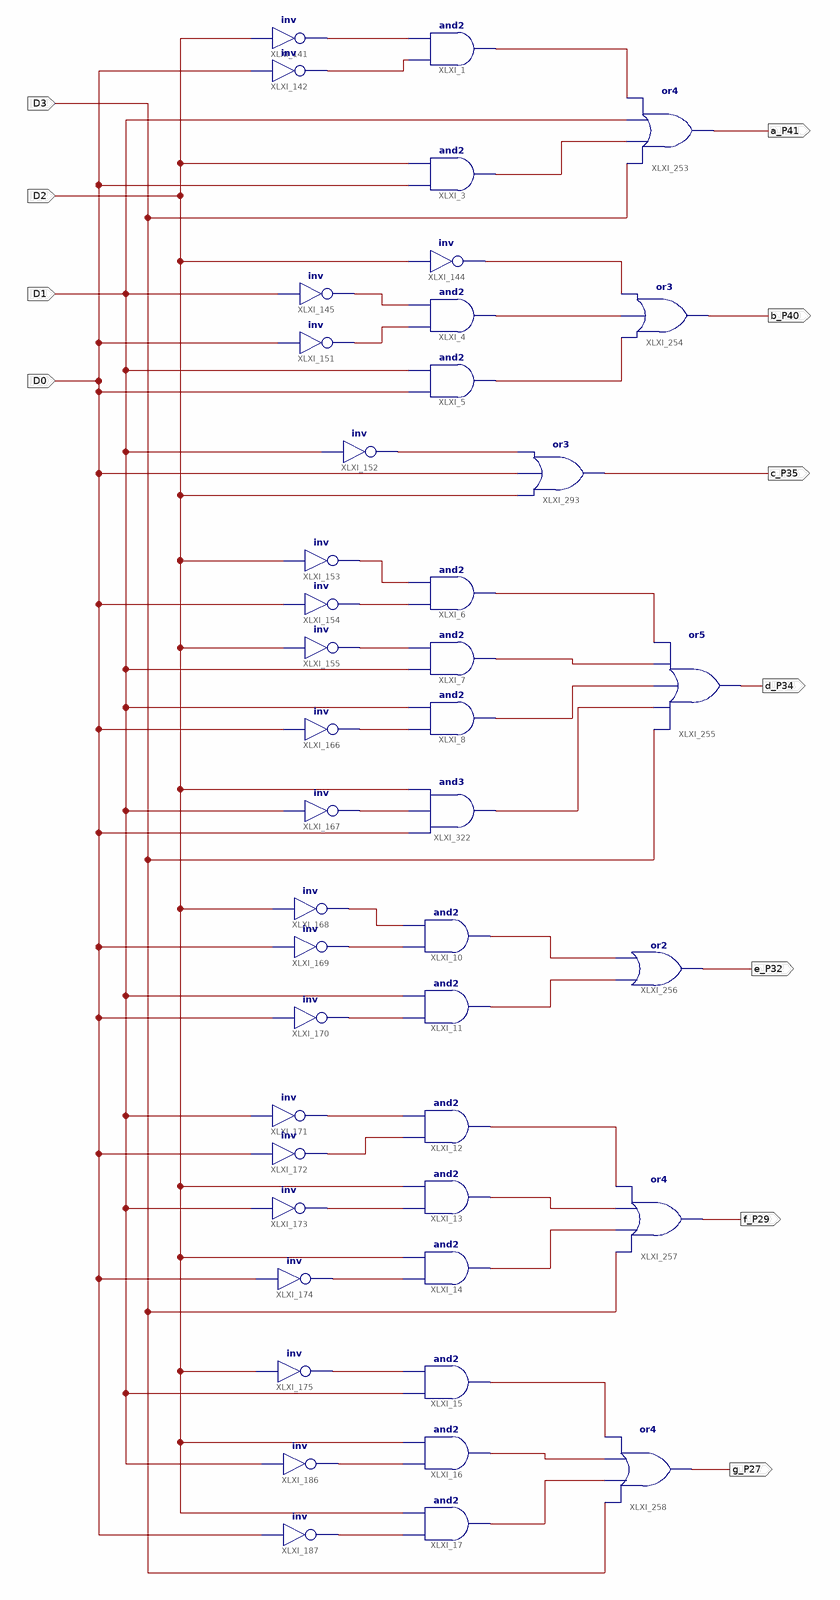
[diagram p0: schematic sheet 1]
// Xilinx ISE schematic sevenSegja.sch (spartan6) as structural Verilog: 44 symbols, 11 ports
module sevenSegja (
  input  D2,
  input  D1,
  input  D0,
  input  D3,
  output a_P41,
  output b_P40,
  output c_P35,
  output d_P34,
  output e_P32,
  output f_P29,
  output g_P27
);

  wire XLXN_11, XLXN_12, XLXN_13, XLXN_15, XLXN_25, XLXN_26, XLXN_27, XLXN_28, XLXN_29, XLXN_30, XLXN_31,
       XLXN_32, XLXN_33, XLXN_34, XLXN_35, XLXN_36, XLXN_37, XLXN_38, XLXN_39, XLXN_40, XLXN_41, XLXN_42,
       XLXN_43, XLXN_44, XLXN_45, XLXN_46, XLXN_47, XLXN_48, XLXN_49, XLXN_50, XLXN_51, XLXN_52, XLXN_53,
       XLXN_54, XLXN_55, XLXN_56, XLXN_57;

  and XLXI_3 (XLXN_15, D0, D2);
  and XLXI_1 (XLXN_13, XLXN_12, XLXN_11);
  not XLXI_141 (XLXN_11, D2);
  not XLXI_142 (XLXN_12, D0);
  not XLXI_144 (XLXN_25, D2);
  or XLXI_253 (a_P41, D3, XLXN_15, D1, XLXN_13);
  or XLXI_254 (b_P40, XLXN_27, XLXN_26, XLXN_25);
  not XLXI_145 (XLXN_28, D1);
  not XLXI_151 (XLXN_29, D0);
  or XLXI_293 (c_P35, D2, D0, XLXN_30);
  not XLXI_152 (XLXN_30, D1);
  and XLXI_6 (XLXN_31, XLXN_36, XLXN_35);
  and XLXI_7 (XLXN_32, D1, XLXN_37);
  and XLXI_8 (XLXN_33, XLXN_38, D1);
  or XLXI_255 (d_P34, D3, XLXN_34, XLXN_33, XLXN_32, XLXN_31);
  not XLXI_153 (XLXN_35, D2);
  not XLXI_154 (XLXN_36, D0);
  not XLXI_155 (XLXN_37, D2);
  not XLXI_166 (XLXN_38, D0);
  and XLXI_322 (XLXN_34, D0, XLXN_39, D2);
  not XLXI_167 (XLXN_39, D1);
  and XLXI_10 (XLXN_40, XLXN_43, XLXN_42);
  and XLXI_11 (XLXN_41, XLXN_44, D1);
  not XLXI_168 (XLXN_42, D2);
  not XLXI_169 (XLXN_43, D0);
  or XLXI_256 (e_P32, XLXN_41, XLXN_40);
  not XLXI_170 (XLXN_44, D0);
  or XLXI_257 (f_P29, D3, XLXN_47, XLXN_46, XLXN_45);
  and XLXI_12 (XLXN_45, XLXN_52, XLXN_51);
  and XLXI_13 (XLXN_46, XLXN_53, D2);
  and XLXI_14 (XLXN_47, XLXN_54, D2);
  not XLXI_171 (XLXN_51, D1);
  not XLXI_173 (XLXN_53, D1);
  not XLXI_174 (XLXN_54, D0);
  not XLXI_172 (XLXN_52, D0);
  or XLXI_258 (g_P27, D3, XLXN_50, XLXN_49, XLXN_48);
  and XLXI_15 (XLXN_48, D1, XLXN_55);
  and XLXI_16 (XLXN_49, XLXN_56, D2);
  not XLXI_175 (XLXN_55, D2);
  not XLXI_186 (XLXN_56, D1);
  not XLXI_187 (XLXN_57, D0);
  and XLXI_17 (XLXN_50, XLXN_57, D2);
  and XLXI_4 (XLXN_26, XLXN_29, XLXN_28);
  and XLXI_5 (XLXN_27, D0, D1);
endmodule
